# Altium schematic sheet DCv1.4.SchDoc
size A4
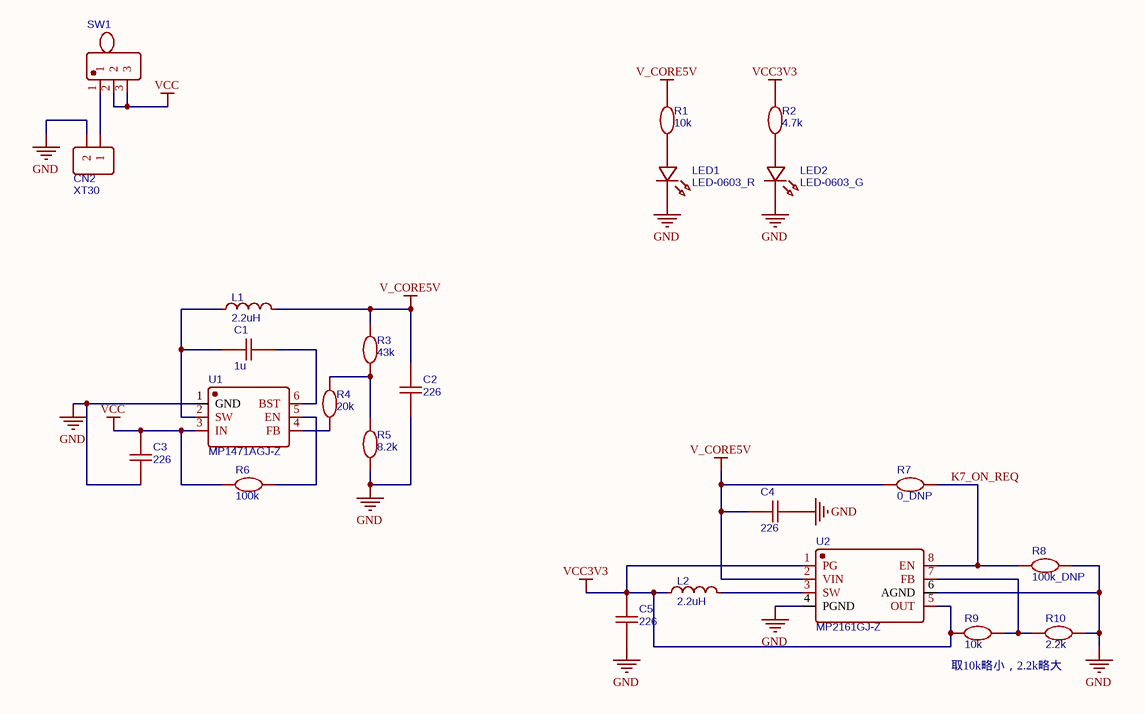
[diagram p0: DCv1.4.SchDoc]

## Parts
C1  1u  [C0603]
C2  226  [C0603]
C3  226  [C0603]
C4  226  [C0603]
C5  226  [C0603]
CN2  XT30  [CONN-TH_XT30UPB-F]
L1  2.2uH  [IND-SMD_L4.4-W4.2]
L2  2.2uH  [IND-SMD_L4.4-W4.2]
LED1  LED-0603_R  [LED0603_RED]
LED2  LED-0603_G  [LED0603_GREEN]
R1  10k  [R0603]
R2  4.7k  [R0603]
R3  43k  [R0603]
R4  20k  [R0603]
R5  8.2k  [R0603]
R6  100k  [R0603]
R7  0_DNP  [R0603]
R8  100k_DNP  [R0603]
R9  10k  [R0603]
R10  2.2k  [R0603]
SW1  2MS1T1B1M1QES-5  [SW-TH_2MD1T1B1M1QES-5]  (value not drawn)
U1  MP1471AGJ-Z  [TSOT-23-6_L2.9-W1.6-P0.95-LS2.8-BR]
U2  MP2161GJ-Z  [TSOT-23-8_L2.9-W1.6-P0.65-LS2.8-BR]

## Nets
GND: C2.1 C3.1 C4.1 C5.1 CN2.2 LED1.2 LED2.2 R5.1 R8.2 R10.2 U1.1(GND) U2.4(PGND) U2.6(AGND)
V_CORE5V: C2.2 C4.2 L1.2 R1.2 R3.2 R7.1 U2.2(VIN)
VCC: C3.2 R6.2 SW1.2 SW1.3 U1.3(IN)
VCC3V3: C5.2 L2.1 R2.2 R9.1 U2.1(PG) U2.5(OUT)
K7_ON_REQ: R7.2 R8.1 U2.8(EN)
NetC1_1: C1.1 L1.1 U1.2(SW)
NetC1_2: C1.2 U1.6(BST)
NetCN2_1: CN2.1 SW1.1
NetL2_2: L2.2 U2.3(SW)
NetLED1_1: LED1.1 R1.1
NetLED2_1: LED2.1 R2.1
NetR3_1: R3.1 R4.2 R5.2
NetR4_1: R4.1 U1.4(FB)
NetR6_1: R6.1 U1.5(EN)
NetR9_2: R9.2 R10.1 U2.7(FB)

## Notes on the sheet
- 取10k略小，2.2k略大

## Library data of the parts
C1-C5 = C0603: nameAlias: Value(F); Contributor: LCEDA_Lib; spicePre: C; spiceSymbolName: C_0603_US
CN2 = XT30: BOM_Manufacturer: Changzhou Amass Elec; BOM_Manufacturer Part: XT30UPB-F; nameAlias: Value; Contributor: LCSC; BOM_Supplier: LCSC; BOM_Supplier Part: C108769; spicePre: C; spiceSymbolName: XT30UPB-F
L1 L2 = L0420: BOM_Manufacturer: Changjiang Microelectronics Tech; BOM_Manufacturer Part: FXL0420-2R2-M; nameAlias: Inductance; Contributor: LCSC; BOM_Supplier: LCSC; BOM_Supplier Part: C167206; spicePre: L; spiceSymbolName: FXL0420-2R2-M
LED1 = LED-0603_R: BOM_Manufacturer: EVERLIGHT(台湾亿光); BOM_Manufacturer Part: 19-217/R6C-AL1M2VY/3T; Contributor: LCEDA_01; BOM_Supplier Part: C72044; BOM_Supplier: LCSC; spicePre: L; spiceSymbolName: LED-0603_R
LED2 = LED-0603_G: BOM_Manufacturer: EVERLIGHT(台湾亿光); BOM_Manufacturer Part: 19-217/GHC-YR1S2/3T; Contributor: LCEDA_Lib; BOM_Supplier Part: C72043; BOM_Supplier: LCSC; spicePre: L; spiceSymbolName: LED-0603_G
R1-R10 = R0603: nameAlias: Value(Ω); Contributor: LCEDA_Lib; spicePre: R; spiceSymbolName: R_0603_EU
SW1 = 2MS1T1B1M1QES-5: BOM_Manufacturer: Dailywell; Contributor: LCSC; BOM_Supplier: LCSC; BOM_Supplier Part: C496169; BOM_Manufacturer Part: 2MS1T1B1M1QES-5; spicePre: S; spiceSymbolName: 2MS1T1B1M1QES-5
U1 = MP1471AGJ-Z: BOM_Manufacturer: MPS; SMT Type: Extend; BOM_Supplier: LCSC; BOM_Manufacturer Part: MP1471AGJ-Z; image: //image.lceda.cn/szlcsc/C58565.jpg; BOM_Supplier Part: C58565; BOM_LCSC Assembly: Yes; spicePre: U; spiceSymbolName: MP1471AGJ-Z
U2 = MP2161GJ-Z: BOM_Manufacturer: MPS; SMT Type: Extend; BOM_Supplier: LCSC; BOM_Manufacturer Part: MP2161GJ-Z; image: //image.lceda.cn/szlcsc/C84831.jpg; BOM_Supplier Part: C84831; BOM_LCSC Assembly: Yes; spicePre: U; spiceSymbolName: MP2161GJ-Z